# Altium schematic sheet rs485_transceiver.SchDoc: RS485 Transceiver
size A4; DocumentNumber: 4; SheetNumber: 4; SheetTotal: 11
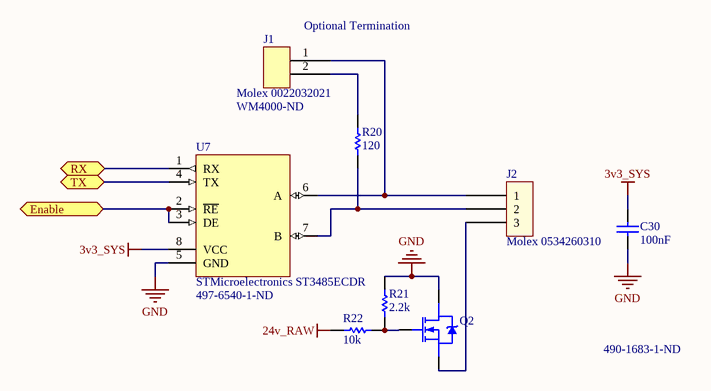
[diagram p0: rs485_transceiver.SchDoc]

## Parts
C30  Capacitance: 100nF  [PCB-3a53f7g8nqmmfsudd9tf-1]  (hidden comment: Murata GRM219R71C104KA01D)
J1  Molex 0022032021  [PCB-ayp4uy6mce3kuznu7cpv-1]
J2  Molex 0534260310  [PCB-uh5qjayc3e5325ry13yq-1]
Q2  2N7002P  [Nexperia 2n7002P]  (value not drawn)
R20  Resistance: 120  [PCB-9ahxsq8gddjqcnfjmojj-1]  (hidden comment: Stackpole Electronics RMCF0603FT120R)
R21  Resistance: 2.2k  [PCB-9ahxsq8gddjqcnfjmojj-1]  (hidden comment: Stackpole Electronics RMCF0603FT120R)
R22  Resistance: 10k  [PCB-9ahxsq8gddjqcnfjmojj-1]  (hidden comment: Stackpole Electronics RMCF0603FT120R)
U7  STMicroelectronics ST3485ECDR  [PCB-lmrwxhl2h1q3b67kej26-1]

## Ports
Enable, RX, TX

## Nets
3v3_SYS: C30.1 U7.8(VCC)
24v_RAW: R22.1
GND: C30.2 Q2.3(D) R21.1 U7.5(GND)
Enable: U7.2(~{RE}) U7.3(DE) ; port Enable
RX: U7.1(RX) ; port RX
TX: U7.4(TX) ; port TX
NetJ1_1: J1.1 J2.1 U7.6(A)
NetJ1_2: J1.2 R20.2
NetJ2_2: J2.2 R20.1 U7.7(B)
NetJ2_3: J2.3 Q2.2(S)
NetQ2_1: Q2.1(G) R21.2 R22.2

## Notes on the sheet
- (near J1) Optional Termination
- (near J1) WM4000-ND
- (near U7) 497-6540-1-ND
- 490-1683-1-ND
- Title
- Size:
- Date:
- A4
- Engineer:
- Time:
- Sheet
- Revision:
- of
- File:

## Library data of the parts
C30 = CMP-f3963a9e29dd2c51-2: 0805 0.1 uF 16 V ±10 % Tolerance X7R Surface Mount Multilayer Ceramic Capacitor; Capacitance Tolerance: ±10%; Case/Package (SI): 2012; Voltage Rating (DC): 16.0 V; Lead-Free Status: Lead Free; OctopartID: f3963a9e29dd2c51; Size-Width: 0.00125 m; Mounting Style: Surface Mount; Octopart URL: http://octopart.com/grm219r71c104ka01d-murata-196397; Size-Thickness: 0.00085 m; Case/Package: 0805; Manufacturer Part Number: GRM219R71C104KA01D; Lifecycle Status: Active; Size-Length: 0.002 m; Size-Height: 0.00085 m; RoHS: Compliant; Dielectric Characteristic: X7R
J1 = CMP-db3d12a8237904fa-2: 2.54mm (.100") Pitch KK® Wire-to-Board Header, Single Row, Vertical, 2 Circuits, PA Polyamide Nylon, Tin (Sn) Plating; Number of Positions: 2; Lifecycle Status: Not Listed by Manufacturer; RoHS: Compliant; OctopartID: db3d12a8237904fa; Octopart URL: http://octopart.com/0022032021-molex-10476834; Manufacturer Part Number: 0022032021
J2 = CMP-86e74f44d2545920-1: Conn Shrouded Header HDR 3 POS 2.5mm Solder RA Thru-Hole Mini-Lock™ Tray; Mounting Style: Solder; Octopart URL: http://octopart.com/0534260310-molex-11104725; OctopartID: 86e74f44d2545920; Lifecycle Status: Not Listed by Manufacturer; RoHS: Compliant
Q2 = CMP-3103171-18: N-Channel 60 V 1.6 Ohm 350 mW 0.8 nC Surface Mount TrenchMOS FET - SOT-23; Lead-Free Status: Lead Free; Mounting Style: Surface Mount; Lifecycle Status: Active; Operating Temperature: -65.0 °C (min); REACH SVHC Compliance: No SVHC; OctopartID: 44a0891b0b019b67; RoHS: Compliant; Number of Pins: 3; Manufacturer Part Number: 2N7002P,215; Packaging: Tape & Reel (TR), Cut Tape (CT); Octopart URL: https://octopart.com/2n7002p%2C215-nexperia-78736071; Case/Package: SOT-23
R20-R22 = CMP-7038b8177fceafff-1: Res Thick Film 0603 120 Ohm 1% 0.1W(1/10W) }100ppm/ Molded SMD Automotive Paper T/R; Lead-Free Status: Lead Free; Power Rating: 100 mW; Octopart URL: https://octopart.com/rmcf0603ft120r-stackpole+electronics-19212944; Manufacturer Part Number: RMCF0603FT120R; Case/Package: 0603; Mounting Style: Surface Mount; Packaging: Tape & Reel (TR); Resistance Tolerance: ±1%; RoHS: Compliant; OctopartID: 7038b8177fceafff
U7 = CMP-4f81868cdec19046-5: ST3485E Series 3.3 V ±15 kV ESD Protected RS-485/RS-422 Transceiver - SOIC-8; Data Rate: 15.0 Mbps; Supply Current: 2.20 mA; Lead-Free Status: Lead Free; Supply Voltage (DC): 3.00 V (min); RoHS: Compliant; Case/Package: SOIC; Mounting Style: Surface Mount; Manufacturer Part Number: ST3485ECDR; REACH SVHC Compliance: No SVHC; Packaging: Cut Tape (CT); Lifecycle Status: Active; OctopartID: 4f81868cdec19046; Number of Pins: 8; Octopart URL: http://octopart.com/st3485ecdr-stmicroelectronics-504870